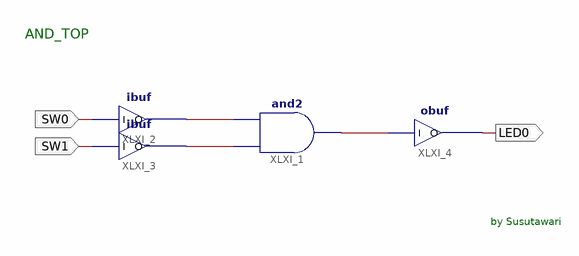
[diagram p0: schematic sheet 1]
// Xilinx ISE schematic AND_TOP.sch (spartan3e) as structural Verilog: 4 symbols, 3 ports
module AND_TOP (
  input  SW0,
  input  SW1,
  output LED0
);

  wire XLXN_1, XLXN_2, XLXN_3;

  and XLXI_1 (XLXN_3, XLXN_2, XLXN_1);
  ibuf XLXI_2 (.I(SW0), .O(XLXN_1));
  ibuf XLXI_3 (.I(SW1), .O(XLXN_2));
  obuf XLXI_4 (.I(XLXN_3), .O(LED0));

  // Notes on the sheet:
  //   AND_TOP
  //   by Susutawari
endmodule
